# Altium schematic sheet Sound.SchDoc: =SheetTitle
size A4; CompanyName: Catcatcat Electronics; Engineer: Hena Chernov; SheetNumber: 7; SheetTotal: 10; CodePhone: +380505759863; SheetDescription: Interactive tactile and audio feedback module.; Email: catcatcat.electronics@gmail.com
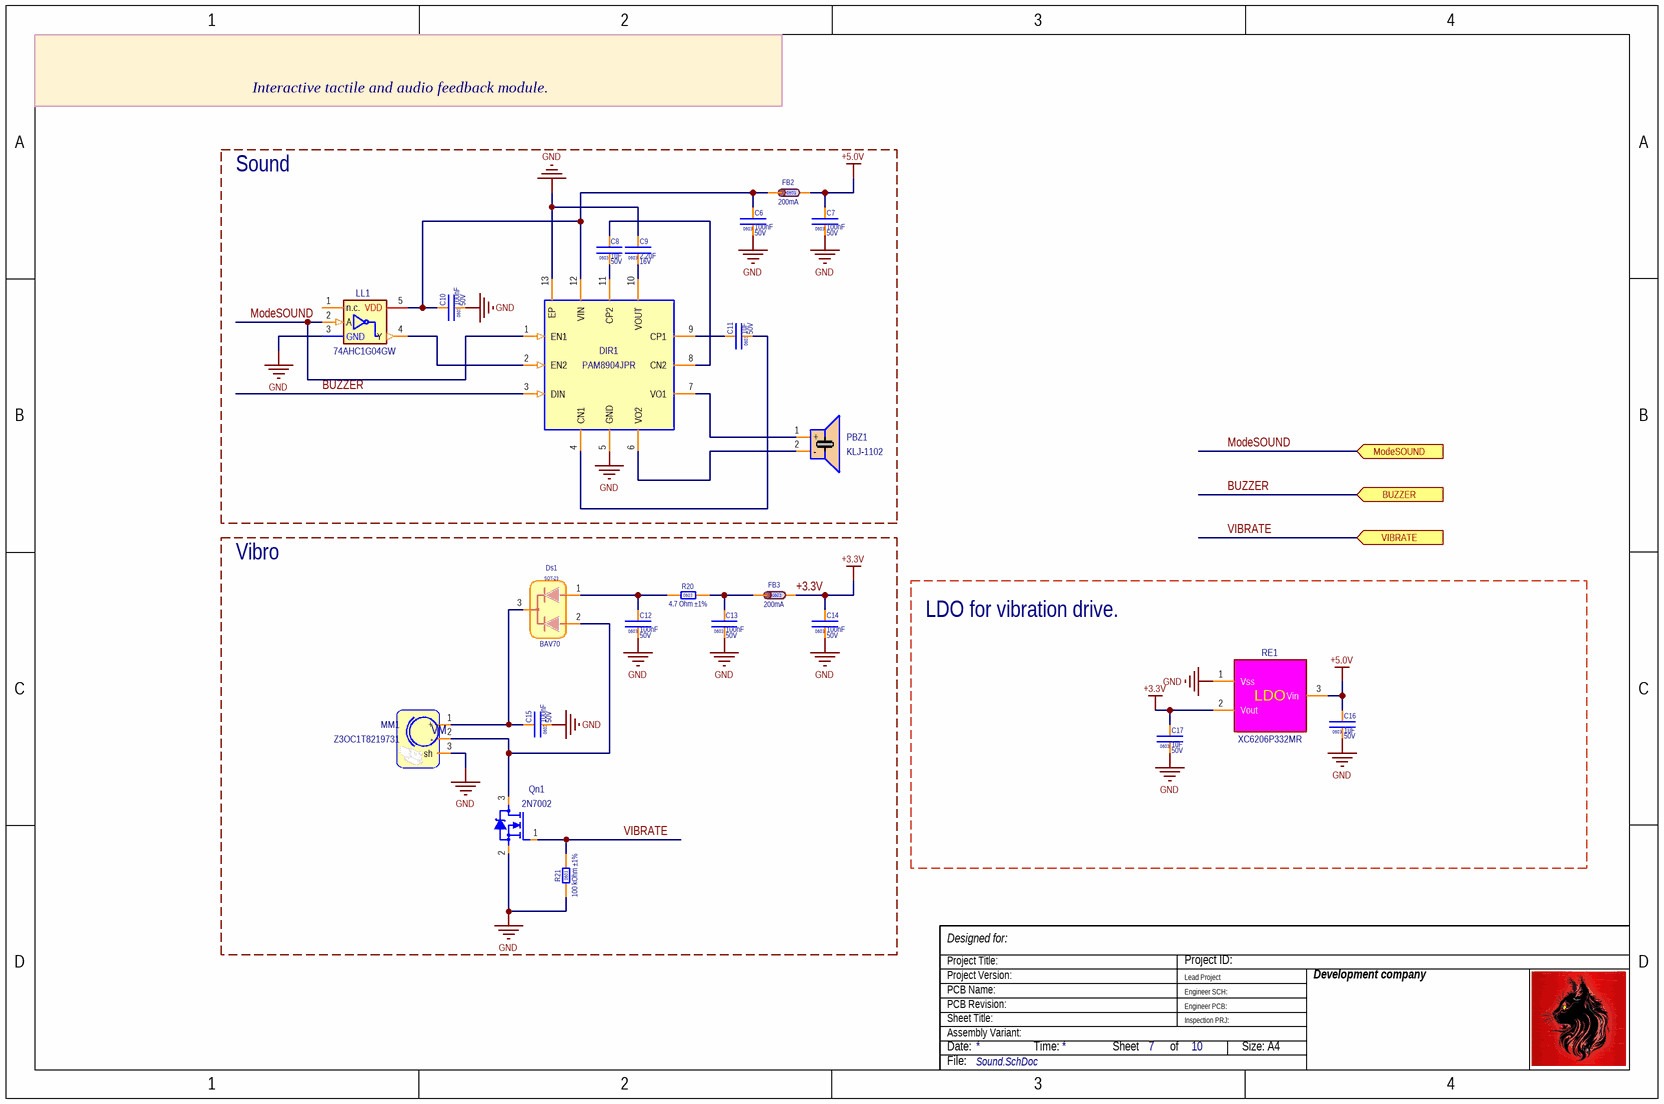
[diagram p0: Sound.SchDoc]

## Parts
C6  value 100nF  Voltage: 50V  [CC0603(1608)x0.8]  (hidden comment: 100 nF ±10% 50V)
C7  value 100nF  Voltage: 50V  [CC0603(1608)x0.8]  (hidden comment: 100 nF ±10% 50V)
C8  value 1uF  Voltage: 50V  [CC0603(1608)x0.8]  (hidden comment: 1uF ±10% 50V 0603)
C9  value 2.2uF  Voltage: 16V  [CC0603(1608)x0.8]  (hidden comment: 2.2uF ±10% 16V 0603)
C10  value 100nF  Voltage: 50V  [CC0603(1608)x0.8]  (hidden comment: 100 nF ±10% 50V)
C11  value 1uF  Voltage: 50V  [CC0603(1608)x0.8]  (hidden comment: 1uF ±10% 50V 0603)
C12  value 100nF  Voltage: 50V  [CC0603(1608)x0.8]  (hidden comment: 100 nF ±10% 50V)
C13  value 100nF  Voltage: 50V  [CC0603(1608)x0.8]  (hidden comment: 100 nF ±10% 50V)
C14  value 100nF  Voltage: 50V  [CC0603(1608)x0.8]  (hidden comment: 100 nF ±10% 50V)
C15  value 100nF  Voltage: 50V  [CC0603(1608)x0.8]  (hidden comment: 100 nF ±10% 50V)
C16  value 1uF  Voltage: 50V  [CC0603(1608)x0.8]  (hidden comment: 1uF ±10% 50V 0603)
C17  value 1uF  Voltage: 50V  [CC0603(1608)x0.8]  (hidden comment: 1uF ±10% 50V 0603)
DIR1  PAM8904JPR  [FP-U-QFN3030-12_Type_B-IPC_C]
Ds1  Case/Package: SOT-23  [SOT-23 - pdf]  (hidden comment: BAV70)
FB2  value 200mA  [FB0603(1608)]  (hidden comment: GZ1608D601TF)
FB3  value 200mA  [FB0603(1608)]  (hidden comment: GZ1608D601TF)
LL1  value 74AHC1G04GW  [SOT353-5-TSSOP-M]  (hidden comment: 74AHC1G04GW,125)
MM1  Z3OC1T8219731  [VibrationMotor]
PBZ1  KLJ-1102  [Cy-SMD-1102-5041]
Qn1  2N7002  [SOT-23 - pdf]
R20  value 4.7 Ohm ±1%  [RC0603(1608) -1%]  (hidden comment: 4.7R ±1% 0603)
R21  value 100 kOhm ±1%  [RC0603(1608) -1%]  (hidden comment: 100K ±1%)
RE1  XC6206P332MR  [FP-SOT23-IPC_C]

## Blocks framed on the sheet
Sound: C6-C11 DIR1 FB2 LL1 PBZ1
Vibro: C12-C15 Ds1 FB3 MM1 Qn1 R20 R21
LDO for vibration drive.: C16 C17 RE1

## Ports
BUZZER (in), ModeSOUND (in), VIBRATE (in)

## Nets
+3.3V: C14.2 C17.2 FB3.2 RE1.2(Vout)
+5.0V: C7.2 C16.2 FB2.2 RE1.3(Vin)
GND: C6.1 C7.1 C9.2 C10.1 C12.1 C13.1 C14.1 C15.1 C16.1 C17.1 DIR1.5(GND) DIR1.13(EP) LL1.3(GND) MM1.3(sh) Qn1.2(S) R21.1 RE1.1(Vss)
BUZZER: DIR1.3(DIN) ; port BUZZER
ModeSOUND: DIR1.1(EN1) LL1.2(A) ; port ModeSOUND
VIBRATE: Qn1.1(G) R21.2 ; port VIBRATE
NetC6_2: C6.2 C10.2 DIR1.12(VIN) FB2.1 LL1.5(VDD)
NetC8_1: C8.1 DIR1.11(CP2)
NetC8_2: C8.2 DIR1.8(CN2)
NetC9_1: C9.1 DIR1.10(VOUT)
NetC11_1: C11.1 DIR1.4(CN1)
NetC11_2: C11.2 DIR1.9(CP1)
NetC12_2: C12.2 Ds1.1 R20.1
NetC13_2: C13.2 FB3.1 R20.2
NetC15_2: C15.2 Ds1.3 MM1.1(+)
NetDIR1_2: DIR1.2(EN2) LL1.4(Y)
NetDIR1_6: DIR1.6(VO2) PBZ1.2(-)
NetDIR1_7: DIR1.7(VO1) PBZ1.1(+)
NetDs1_2: Ds1.2 MM1.2(-) Qn1.3(D)

Not connected (* = marked no-connect by the designer): LL1 1(n.c.)

## Notes on the sheet
- Project Title:
- Project Version:
- Designed for:
- Lead Project
- Project ID:
- Development company
- Date:
- PCB Revision:
- PCB Name:
- Sheet Title:
- Assembly Variant:
- Time:
- Sheet
- of
- Engineer SCH:
- Engineer PCB:
- Inspection PRJ:
- Size: A4
- File:
- (in symbol XC6206P332MR (B)) LDO
- (in symbol Z3OC1T8219731 (E)) VM

## Library data of the parts
C6 C7 C10 C12-C15 = 0603 0.1 uF (B): 100 nF ±10% 50V X7R; Manufacturer 1: YAGEO; Manufacturer Part Number 1: CC0603KRX7R9BB104; Note: Ceramic Capacitors; Detailed Description: 50V 100nF X7R ±10% 0603  Multilayer Ceramic Capacitors MLCC - SMD/SMT ROHS; Case/Package: 0603; Publisher: Catcatcat Electronics; Tolerance: ±10%; HelpURL: https://datasheet.lcsc.com/lcsc/1809301912_YAGEO-CC0603KRX7R9BB104_C14663.pdf; website developer: http://catcatcat.d-lan.dp.ua/; Temperature Coefficient: X7R; Supplier URL 1: https://jlcpcb.com/parts/componentSearch?searchTxt=; Operating Temperature: -55C to +125C; Supplier Part Number 1: C14663; Supplier Unit Price 1: 0.0021; Assembly type: Basic Part; Footprint check status: Verified; QuantityElements: 1; Supplier 1: LCSC; MountType: SMD
C8 C11 C16 C17 = 0603 1.0 uF 50V (B): 1.0 uF ±10% 50V X5R; Manufacturer 1: Samsung Electro-Mechanics; Manufacturer Part Number 1: CL10A105KB8NNNC; Note: Ceramic Capacitors; Detailed Description: 50V 1uF X5R ±10% 0603  Multilayer Ceramic Capacitors MLCC - SMD/SMT ROHS; Case/Package: 0603; Publisher: Catcatcat Electronics; Tolerance: ±10%; HelpURL: https://datasheet.lcsc.com/szlcsc/Samsung-Electro-Mechanics-CL10A105KB8NNNC_C15849.pdf; Website Developer: http://catcatcat.d-lan.dp.ua/; Temperature Coefficient: X5R; Supplier URL 1: https://jlcpcb.com/parts/componentSearch?searchTxt=; Operating Temperature: -55C to +125C; Supplier Part Number 1: C15849; Supplier Unit Price 1: 0.0051; Assembly type: Basic Part; Footprint check status: Verified; QuantityElements: 1; Supplier 1: LCSC; MountType: SMD
C9 = 0603 2.2 uF 16V (B): 2.2 uF ±10% 16V X5R; Manufacturer 1: Samsung Electro-Mechanics; Manufacturer Part Number 1: CL10A225KO8NNNC; Note: Ceramic Capacitors; Detailed Description: 16V 2.2uF X5R ±10% 0603  Multilayer Ceramic Capacitors MLCC - SMD/SMT ROHS; Case/Package: 0603; Publisher: Catcatcat Electronics; Tolerance: ±10%; HelpURL: https://datasheet.lcsc.com/szlcsc/Samsung-Electro-Mechanics-CL10A225KO8NNNC_C23630.pdf; website developer: http://catcatcat.d-lan.dp.ua/; Temperature Coefficient: X5R; Supplier URL 1: https://jlcpcb.com/parts/componentSearch?searchTxt=; Operating Temperature: -55C to +125C; Supplier Part Number 1: C23630; Supplier Unit Price 1: 0.0059; Assembly type: Basic Part; Footprint check status: Verified; QuantityElements: 1; Supplier 1: LCSC; MountType: SMD
DIR1 = PAM8904JPR (E): PIEZO SOUNDER DRIVER 18VPP OUTPUT; Manufacturer 1: Diodes Incorporated; Note: A/D converter; Temp.Characteristic: -40°C ~ 85°C (TA); Voltage: 1.8V to 5.5V; Output Impedance: Ohms; Output Power: W; Total Harmonic Distortion: %; Supplier URL 1: https://www.lcsc.com/product-detail/Audio-Power-OpAmps_Diodes-Incorporated-PAM8904JPR_C780875.html; HelpURL: https://datasheet.lcsc.com/lcsc/2210281000_Diodes-Incorporated-PAM8904JPR_C780875.pdf; Manufacturer Part Number 1: PAM8904JPR; Case/Package: UQFN3030-12; Supplier Unit Price 1: 0.4560; Publisher: Catcatcat Electronics; Website Developer: http://catcatcat.d-lan.dp.ua/; Detailed Description: PIEZO SOUNDER DRIVER 18VPP OUTPUT; Operating Temperature: -40 to +85°C; Supplier Part Number 1: C780875; Assembly type: Extended Part; Footprint check status: Verified; QuantityElements: 1; Supplier 1: LCSC; MountType: SMD; ECCN: EAR99; Value: PAM8904JPR
Ds1 = BAV70 (B): Switching SOT-23, 200 mA 70 V; Manufacturer 1: Changjiang Electronics Tech (CJ); Temp.Characteristic: -40C to +85C; Voltage: 70 V; Note: Diode; Marking: A4; Detailed Description: 70V +150℃@(Tj) 225mW Dual Common Cathode 1.25V@150mA 6ns 2.5uA@70V 200mA SOT-23  Switching Diode ROHS; Current: 150mA; Reverse Current (uA/5V/25°C): uA; Publisher: Catcatcat Electronics; HelpURL: https://datasheet.lcsc.com/lcsc/1809211023_Jiangsu-Changjing-Electronics-Technology-Co---Ltd--BAV70_C68978.pdf; Manufacturer Part Number 1: BAV70; Website developer: http://catcatcat.d-lan.dp.ua/; Supplier URL 1: https://www.lcsc.com/product-detail/Switching-Diode_Jiangsu-Changjing-Electronics-Technology-Co-Ltd-BAV70_C68978.html; Supplier Part Number 1: C68978; Supplier Unit Price 1: 0.0195; Assembly type: Basic Part; Footprint check status: Verified; QuantityElements: 1; Supplier 1: LCSC; MountType: SMD; Value: BAV70
FB2 FB3 = 0603 GZ1608D601TF (B): 0.20A 600 Ohm @100MHz 450 mOhm; Manufacturer 1: Sunlord; Temp.Characteristic: -55°C ~ 125°C; Note: Ferrite Beads and Chips; Detailed Description: 450mΩ ±25% 600Ω@100MHz 0603  Ferrite Beads ROHS; Case/Package: 0603; Publisher: Catcatcat Electronics; HelpURL: https://datasheet.lcsc.com/lcsc/1811091241_Sunlord-GZ1608D601TF_C1002.pdf; website developer: http://catcatcat.d-lan.dp.ua/; Manufacturer Part Number 1: GZ1608D601TF; Supplier URL 1: https://jlcpcb.com/parts/componentSearch?searchTxt=; Supplier Part Number 1: C1002; Supplier Unit Price 1: 0.0045; Assembly type: Basic Part; Footprint check status: Verified; QuantityElements: 1; Supplier 1: LCSC; MountType: SMD
LL1 = 74AHC1G04GW,125 (E): IC INVERTER 1CH 1-INP 5TSSOP; Manufacturer 1: Nexperia USA Inc.; Voltage: 2 V ~ 5.5 V; Note: Inverter IC 1 Channel; Detailed Description: Inverter IC 1 Channel  5-TSSOP; Supplier URL 1: https://www.digikey.com/product-detail/en/nexperia-usa-inc/74AHC1G04GW125/1727-3147-2-ND/1022776; Publisher: Catcatcat Electronics; Operating Temperature: -40°C ~ 125°C (TA); HelpURL: https://assets.nexperia.com/documents/data-sheet/74AHC_AHCT1G04.pdf; Manufacturer Part Number 1: 74AHC1G04GW,125; Website developer: http://catcatcat.d-lan.dp.ua/; Case/Package: 5-TSSOP, SC-70-5, SOT-353; Supplier Part Number 1: C148197; Supplier Unit Price 1: 0.0493; Assembly type: Extended Part; Footprint check status: Verified; QuantityElements: 1; Supplier 1: LCSC; MountType: SMD
MM1 = Z3OC1T8219731 (E): DC Motor Vibration, ROHS; Manufacturer 1: KOTL; Note: Micro Motor & Motor ROHS; Voltage: 2-3.6V; Assembly type: Extended Part; HelpURL: https://www.endrich.com/sixcms/media.php/2/Z30C1T8219651.pdf; Manufacturer Part Number 1: Z3OC1T8219731; Case/Package: SMD; Supplier Part Number 1: C2894731; Supplier Unit Price 1: 0.6504; Publisher: Catcatcat Electronics; Website developer: http://catcatcat.d-lan.dp.ua/; Footprint check status: Verified; QuantityElements: 1; Supplier 1: LCSC; MountType: Plug-in; Value: Z3OC1T8219731
PBZ1 = KLJ-1102 (E): Piezoelectric buzzer, Externally Driven 70dB@5V,10cm Externally Driven SMD,9x11mm  Buzzers ROHS; Manufacturer 1: KELIKING; Voltage: 5V; Current: ≤120mA; Sound Pressure Level (dB/min.): ≥75dB; Assembly type: Extended Part; Supplier URL 1: https://www.lcsc.com/product-detail/Buzzers_KELIKING-KLJ-1102_C201047.html; Detailed Description: Externally Driven 70dB@5V,10cm Externally Driven SMD,9x11mm  Buzzers ROHS; HelpURL: https://datasheet.lcsc.com/lcsc/1808301123_KELIKING-KLJ-1102_C201047.pdf; Manufacturer Part Number 1: KLJ-1102; Note: Piezoelectric buzzer; Operating Temperature: -20 ~ +80; Case/Package: SMD,9x11mm; Supplier Part Number 1: C201047; Supplier Unit Price 1: 0.4680; Publisher: Catcatcat Electronics; Website developer: http://catcatcat.d-lan.dp.ua/; Footprint check status: Verified; QuantityElements: 1; Supplier 1: LCSC; MountType: SMD; Value: KLJ-1102
Qn1 = 2N7002 (B): N-Channel SOT-23 60V 115mA 200mW 7.5Ω@10V,500mA 2.5V@250uA  SOT-23(SOT-23-3)  MOSFETs ROHS; Manufacturer 1: Changjiang Electronics Tech (CJ); Note: Transistor; Temp.Characteristic: -40C to +85C; Marking: 7002; Detailed Description: 60V 115mA 200mW 7.5Ω@10V,500mA 2.5V@250uA N Channel SOT-23(SOT-23-3)  MOSFETs ROHS; Supplier Unit Price 1: 0.0139; Publisher: Catcatcat Electronics; Voltage: 60V; Supplier URL 1: https://jlcpcb.com/parts/componentSearch?searchTxt=C8545; HelpURL: https://datasheet.lcsc.com/szlcsc/Changjiang-Electronics-Tech-CJ-2N7002_C8545.pdf; Manufacturer Part Number 1: 2N7002; Website developer: http://catcatcat.d-lan.dp.ua/; Operating Temperature: -55°C ~ 150°C (TJ); Case/Package: SOT-23; Supplier Part Number 1: C8545; Assembly type: Basic Part; Footprint check status: Verified; QuantityElements: 1; Supplier 1: LCSC; MountType: SMD; Value: 2N7002
R20 = 0603 4.7 Ohm ±1% (B): 4.7 R (4R7) ±1% 1/10W 75V; Manufacturer 1: UNI-ROYAL(Uniroyal Elec); Manufacturer Part Number 1: 0603WAF470KT5E; Note: Chip Resistor - Surface Mount; Temperature Coefficient: ±400ppm/℃; Detailed Description: 100mW Thick Film Resistors ±1% ±400ppm/℃ 4.7Ω 0603  Chip Resistor - Surface Mount ROHS; Publisher: Catcatcat Electronics; Tolerance: ±1%; Voltage: 75V; HelpURL: https://datasheet.lcsc.com/lcsc/2206010116_UNI-ROYAL-Uniroyal-Elec-0603WAF470KT5E_C23164.pdf; Marking: 4R7; Power (Watts): 1/10W; Supplier URL 1: https://www.lcsc.com/product-detail/Chip-Resistor-Surface-Mount_UNI-ROYAL-Uniroyal-Elec-0603WAF470KT5E_C23164.html; Manufacturer URL: http://uniohm.com/; Operating Temperature: -55°C ~ 155°C; Supplier Part Number 1: C23164; Supplier Unit Price 1: 0.0014; Assembly type: Basic Part; Footprint check status: Verified; QuantityElements: 1; Supplier 1: LCSC; Website Developer: http://catcatcat.d-lan.dp.ua/; MountType: SMD; Case/Package: 0603
R21 = 0603 100 kOhm ±1% (B): 100 k (104) ±1% 1/10W 50V; Manufacturer 1: UNI-ROYAL(Uniroyal Elec); Manufacturer Part Number 1: 0603WAF1003T5E; Note: Chip Resistor - Surface Mount; Temperature Coefficient: ±100 ppm/℃; Detailed Description: 100mW Thick Film Resistors ±100ppm/℃ ±1% 100kΩ 0603  Chip Resistor - Surface Mount ROHS; Publisher: Catcatcat Electronics; Tolerance: ±1%; Voltage: 50V; HelpURL: https://datasheet.lcsc.com/szlcsc/Uniroyal-Elec-0603WAF1003T5E_C25803.pdf; Power (Watts): 1/10W; Supplier URL 1: https://jlcpcb.com/parts/componentSearch?searchTxt=C25803; Operating Temperature: -55°C ~ 155°C; Supplier Part Number 1: C25803; Supplier Unit Price 1: 0.0009; Assembly type: Basic Part; Footprint check status: Verified; QuantityElements: 1; Supplier 1: LCSC; Website Developer: http://catcatcat.d-lan.dp.ua/; MountType: SMD; Case/Package: 0603
RE1 = XC6206P332MR (B): LDO 5.0V 3.3V 200mA Fixed 3.3V~3.3V Positive 6V SOT-23-3L  Linear Voltage Regulators (LDO) ROHS; Manufacturer 1: Torex Semicon; Note: LOW DROPOUT REGULATORS(LDO); Marking: 662V; Voltage - Input (Min)/(Max): 5V; Supplier URL 1: https://jlcpcb.com/parts/componentSearch?searchTxt=C5446; Case/Package: SOT-23-3L; Supplier Part Number 1: C5446; Operating Temperature: -40C to +85C; Voltage: 3.3V; HelpURL: https://eu.mouser.com/datasheet/2/760/TOSL_S_A0007229533_1-2575067.pdf; Manufacturer Part Number 1: XC6206P332MR; Detailed Description: 200mA Fixed 3.3V~3.3V Positive 6V SOT-23-3L  Linear Voltage Regulators (LDO) ROHS; Supplier Unit Price 1: 0.0992; Publisher: Catcatcat Electronics; Website developer: http://catcatcat.d-lan.dp.ua/; Assembly type: Basic Part; Footprint check status: Verified; Current - Output (Max): 200mA; QuantityElements: 1; Supplier 1: LCSC; MountType: SMD; Value: XC6206P332MR